# Altium schematic sheet Power.SchDoc
size A4; DocumentNumber: 4; SheetNumber: 4; SheetTotal: 6; sheetTitle: E-ink display
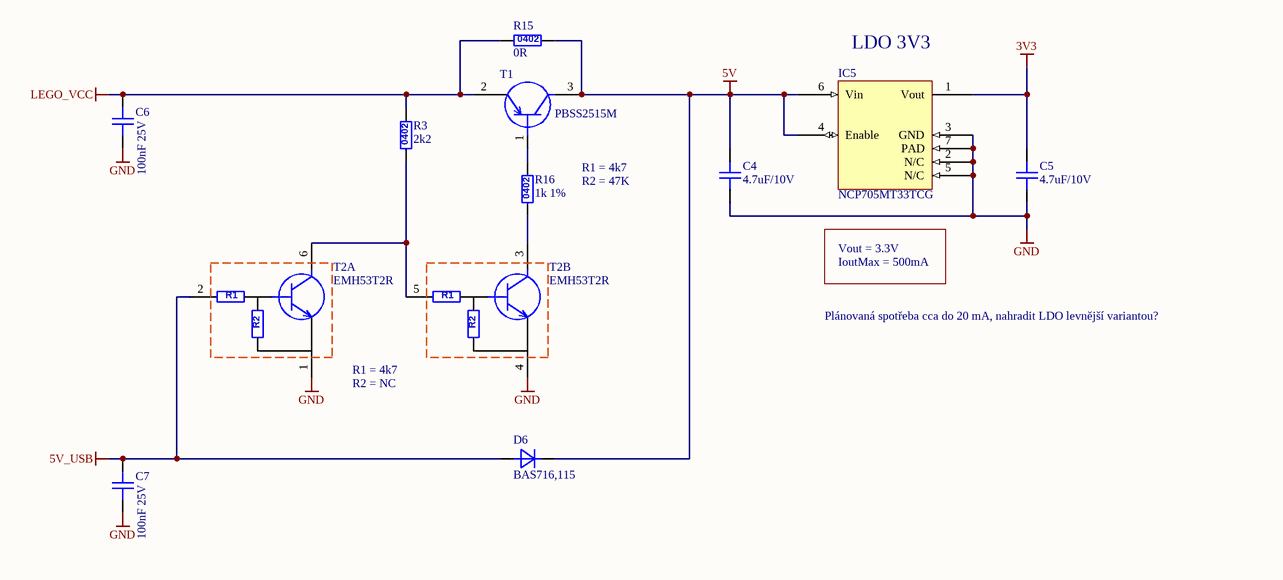
[diagram p0: Power.SchDoc]

## Parts
C4  value 4.7uF/10V  [C0402_big]  (hidden comment: UniversalCapacitor)
C5  value 4.7uF/10V  [C0402_big]  (hidden comment: UniversalCapacitor)
C6  value 100nF 25V  [C0402]  (hidden comment: UniversalCapacitor)
C7  value 100nF 25V  [C0402]  (hidden comment: UniversalCapacitor)
D6  value BAS716,115  [SOD523]  (hidden comment: Diode)
IC5  value NCP705MT33TCG  [WDFN6]  (hidden comment: VoltageRegulator-Fixed08)
R3  value 2k2  [R0402]  (hidden comment: UniversalResistor0402)
R15  value 0R  [R0402]  (hidden comment: UniversalResistor0402)
R16  value 1k 1%  [R0402]  (hidden comment: UniversalResistor0402)
T1  value PBSS2515M  [DFN1006-3]  (hidden comment: PNP)
T2  value EMH53T2R  [SOT-563-6]  (hidden comment: NPN_DUAL)  (parts A,B of 2)

## Nets
3V3: C5.1 IC5.1(Vout)
5V: C4.1 D6.2(C) IC5.4(Enable) IC5.6(Vin) R15.1 T1.3(C)
5V_USB: C7.2 D6.1(A) T2.2(E)
GND: C4.2 C5.2 C6.1 C7.1 IC5.2(N/C) IC5.3(GND) IC5.5(N/C) IC5.7(PAD) T2.1(B) T2.4(e)
LEGO_VCC: C6.2 R3.1 R15.2 T1.2(E)
NetR3_2: R3.2 T2.5(E) T2.6(C)
NetR16_1: R16.1 T1.1(B)
NetR16_2: R16.2 T2.3(C)

## Notes on the sheet
- (near IC5) LDO 3V3
- R1 = 4k7
- R2 = 47K
- Vout = 3.3V
- IoutMax = 500mA
- (near T2) R1 = 4k7
- Plánovaná spotřeba cca do 20 mA, nahradit LDO levnější variantou?
- (near T2) R2 = NC
- Title:
- Size:
- Date:
- A4
- Number:
- Time:
- Revision:
- Sheet
- of
- Autor:
- Project:
- File:
- (in symbol CRCW04021K00FKED) 0402
- (in symbol CRCW04022K20FKED) 0402
- (in symbol CRCW04020000Z0ED) 0402
- (in symbol EMH53T2R, part A) R1; R2
- (in symbol EMH53T2R, part B) R1; R2

## Library data of the parts
C4 C5 = GRM155R61A475MEAAD: MURATA - GRM155R61A475MEAAD - CAP, MLCC, X5R, 4.7UF, 10V, 0402; part_id: 2175; name: GRM155R61A475MEAAD; Supplier 1: Farnell; Supplier Part Number 1: 2688503; ComponentLink1URL: http://cz.farnell.com/2688503?Ntt=2688503; HelpURL: http://www.farnell.com/datasheets/2189109.pdf; footprint_name: C0402_big; schematic_name: UniversalCapacitor
C6 C7 = 0402B104K250CT: WALSIN - 0402B104K250CT - CAPACITOR, MLCC, X7R, 0.1UF, 25V, 0402; part_id: 2099; name: 0402B104K250CT; Supplier 1: Farnell; Supplier Part Number 1: 2496772; ComponentLink1URL: http://cz.farnell.com/2496772?Ntt=2496772; HelpURL: http://www.farnell.com/datasheets/2340522.pdf; footprint_name: C0402; schematic_name: UniversalCapacitor
D6 = BAS716,115: NEXPERIA - BAS716,115 - Small Signal Diode, Single, 85 V, 200 mA, 1.25 V, 3 µs, 4 A; part_id: 2944; name: BAS716,115; Supplier 1: Farnell; Supplier Part Number 1: 8734500; ComponentLink1URL: http://cz.farnell.com/8734500?Ntt=8734500; HelpURL: http://www.farnell.com/datasheets/674433.pdf; footprint_name: SOD523; schematic_name: Diode
IC5 = NCP705MT33TCG: Regulátory napětí s nízkým úbytkem (LDO) 500 MA LDO ULTRA-LOW IQ; part_id: 2970; name: NCP705MT33TCG; Supplier 1: Mouser; Supplier Part Number 1: 863-NCP705MT33TCG; ComponentLink1URL: https://cz.mouser.com/ProductDetail/onsemi/NCP705MT33TCG?qs=l5F7KFZg3O5BAqXCIJeMgQ%3D%3D; HelpURL: https://cz.mouser.com/datasheet/2/308/NCP705_D-1812761.pdf; footprint_name: WDFN6; schematic_name: VoltageRegulator-Fixed08
R3 = CRCW04022K20FKED: VISHAY - CRCW04022K20FKED. - RES, THICK FILM, 2K2, 1%, 0.063W, 0402; part_id: 2177; name: CRCW04022K20FKED; Supplier 1: Farnell; Supplier Part Number 1: 2140802; ComponentLink1URL: http://cz.farnell.com/2140802?Ntt=2140802; HelpURL: http://www.farnell.com/datasheets/2310790.pdf; footprint_name: R0402; schematic_name: UniversalResistor0402
R15 = CRCW04020000Z0ED: VISHAY - CRCW04020000Z0ED - RESISTOR, 0R, 0.063W, JUMPER, 0402, SMD; name: CRCW04020000Z0ED; Supplier 1: Farnell; Supplier Part Number 1: 1469661; ComponentLink1URL: http://cz.farnell.com/1469661?Ntt=1469661; HelpURL: http://www.farnell.com/datasheets/2310790.pdf
R16 = CRCW04021K00FKED: VISHAY - CRCW04021K00FKED - RES, THICK FILM, 1K, 1%, 0.063W, 0402; part_id: 2180; name: CRCW04021K00FKED; Supplier 1: Farnell; Supplier Part Number 1: 1469662; ComponentLink1URL: http://cz.farnell.com/1469662?Ntt=1469662; HelpURL: http://www.farnell.com/datasheets/2310790.pdf; footprint_name: R0402; schematic_name: UniversalResistor0402
T1 = PBSS2515M,315: NEXPERIA - PBSS2515M,315 - TRANSISTOR, BIPOLAR; name: PBSS2515M,315; Supplier 1: Mouser; Supplier Part Number 1: 771-PBSS2515M315; ComponentLink1URL: https://cz.mouser.com/ProductDetail/Nexperia/PBSS2515M315?qs=LOCUfHb8d9svQrHgrvn9Qw%3D%3D; HelpURL: https://4donline.ihs.com/images/VipMasterIC/IC/PIRS/PIRSS00607/PIRSS00607-1.pdf?hkey=6D3A4C79FDBF58556ACFDE234799DDF0
T2 = EMH53T2R: ROHM - EMH53T2R - Bipolar Pre-Biased / Digital Transistor, Dual NPN, 50 V, 100 mA, 4.7 kohm; part_id: 2971; name: EMH53T2R; Supplier 1: Farnell; Supplier Part Number 1: 3757495; ComponentLink1URL: http://cz.farnell.com/3757495?Ntt=3757495; HelpURL: http://www.farnell.com/datasheets/3209004.pdf; footprint_name: SOT-563-6; schematic_name: NPN_DUAL